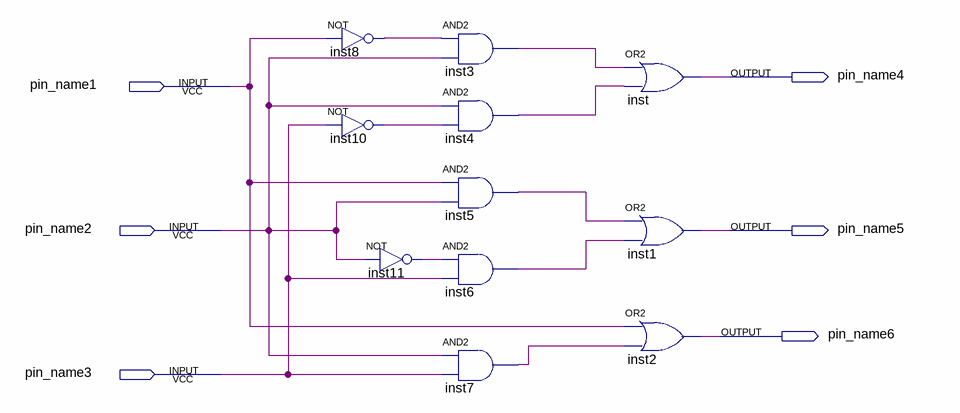
[diagram p0: schematic sheet]
// Quartus schematic transkoder.bdf as structural Verilog: 11 symbols, 6 pins
module transkoder (
  input  pin_name1,
  input  pin_name2,
  input  pin_name3,
  output pin_name4,
  output pin_name5,
  output pin_name6
);

  wire inst3_out, inst4_out, inst5_out, inst6_out, inst7_out, inst8_out, inst10_out, inst11_out;

  not inst8 (inst8_out, pin_name1);
  not inst10 (inst10_out, pin_name3);
  not inst11 (inst11_out, pin_name2);
  and inst3 (inst3_out, inst8_out, pin_name2);
  and inst4 (inst4_out, pin_name2, inst10_out);
  and inst5 (inst5_out, pin_name1, pin_name2);
  and inst6 (inst6_out, inst11_out, pin_name3);
  and inst7 (inst7_out, pin_name2, pin_name3);
  or inst (pin_name4, inst3_out, inst4_out);
  or inst1 (pin_name5, inst5_out, inst6_out);
  or inst2 (pin_name6, pin_name1, inst7_out);
endmodule
